# EAGLE design LPC2368 Breakout (EAGLE 6.2)
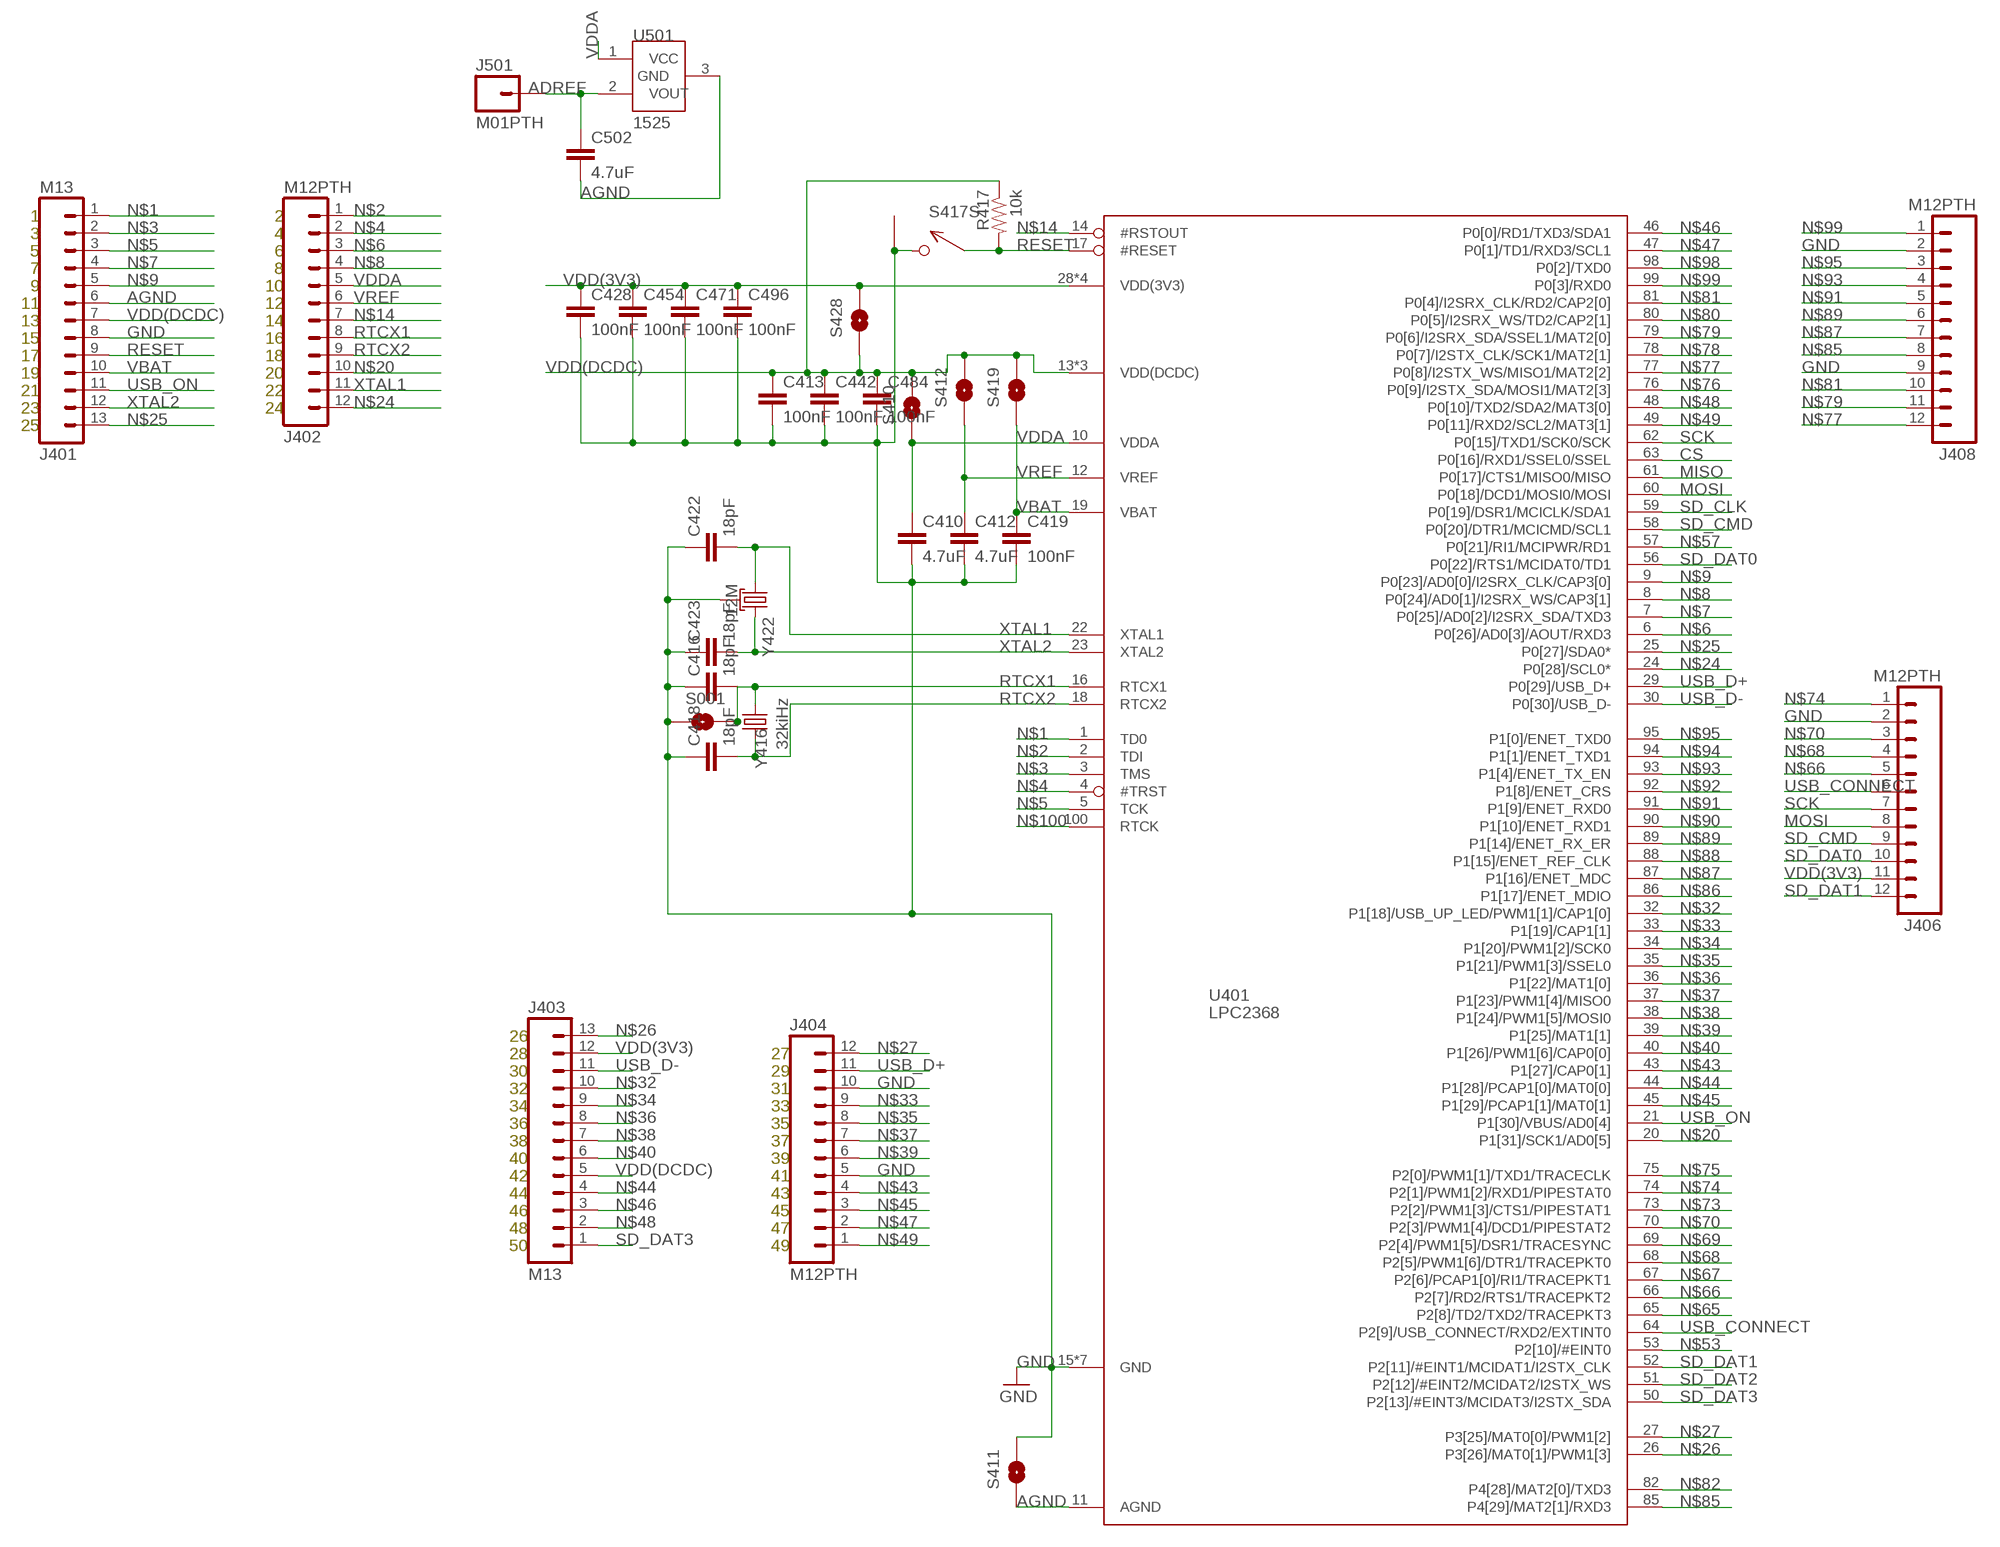
[diagram p0: schematic, sheet 1, part 1 of 2]
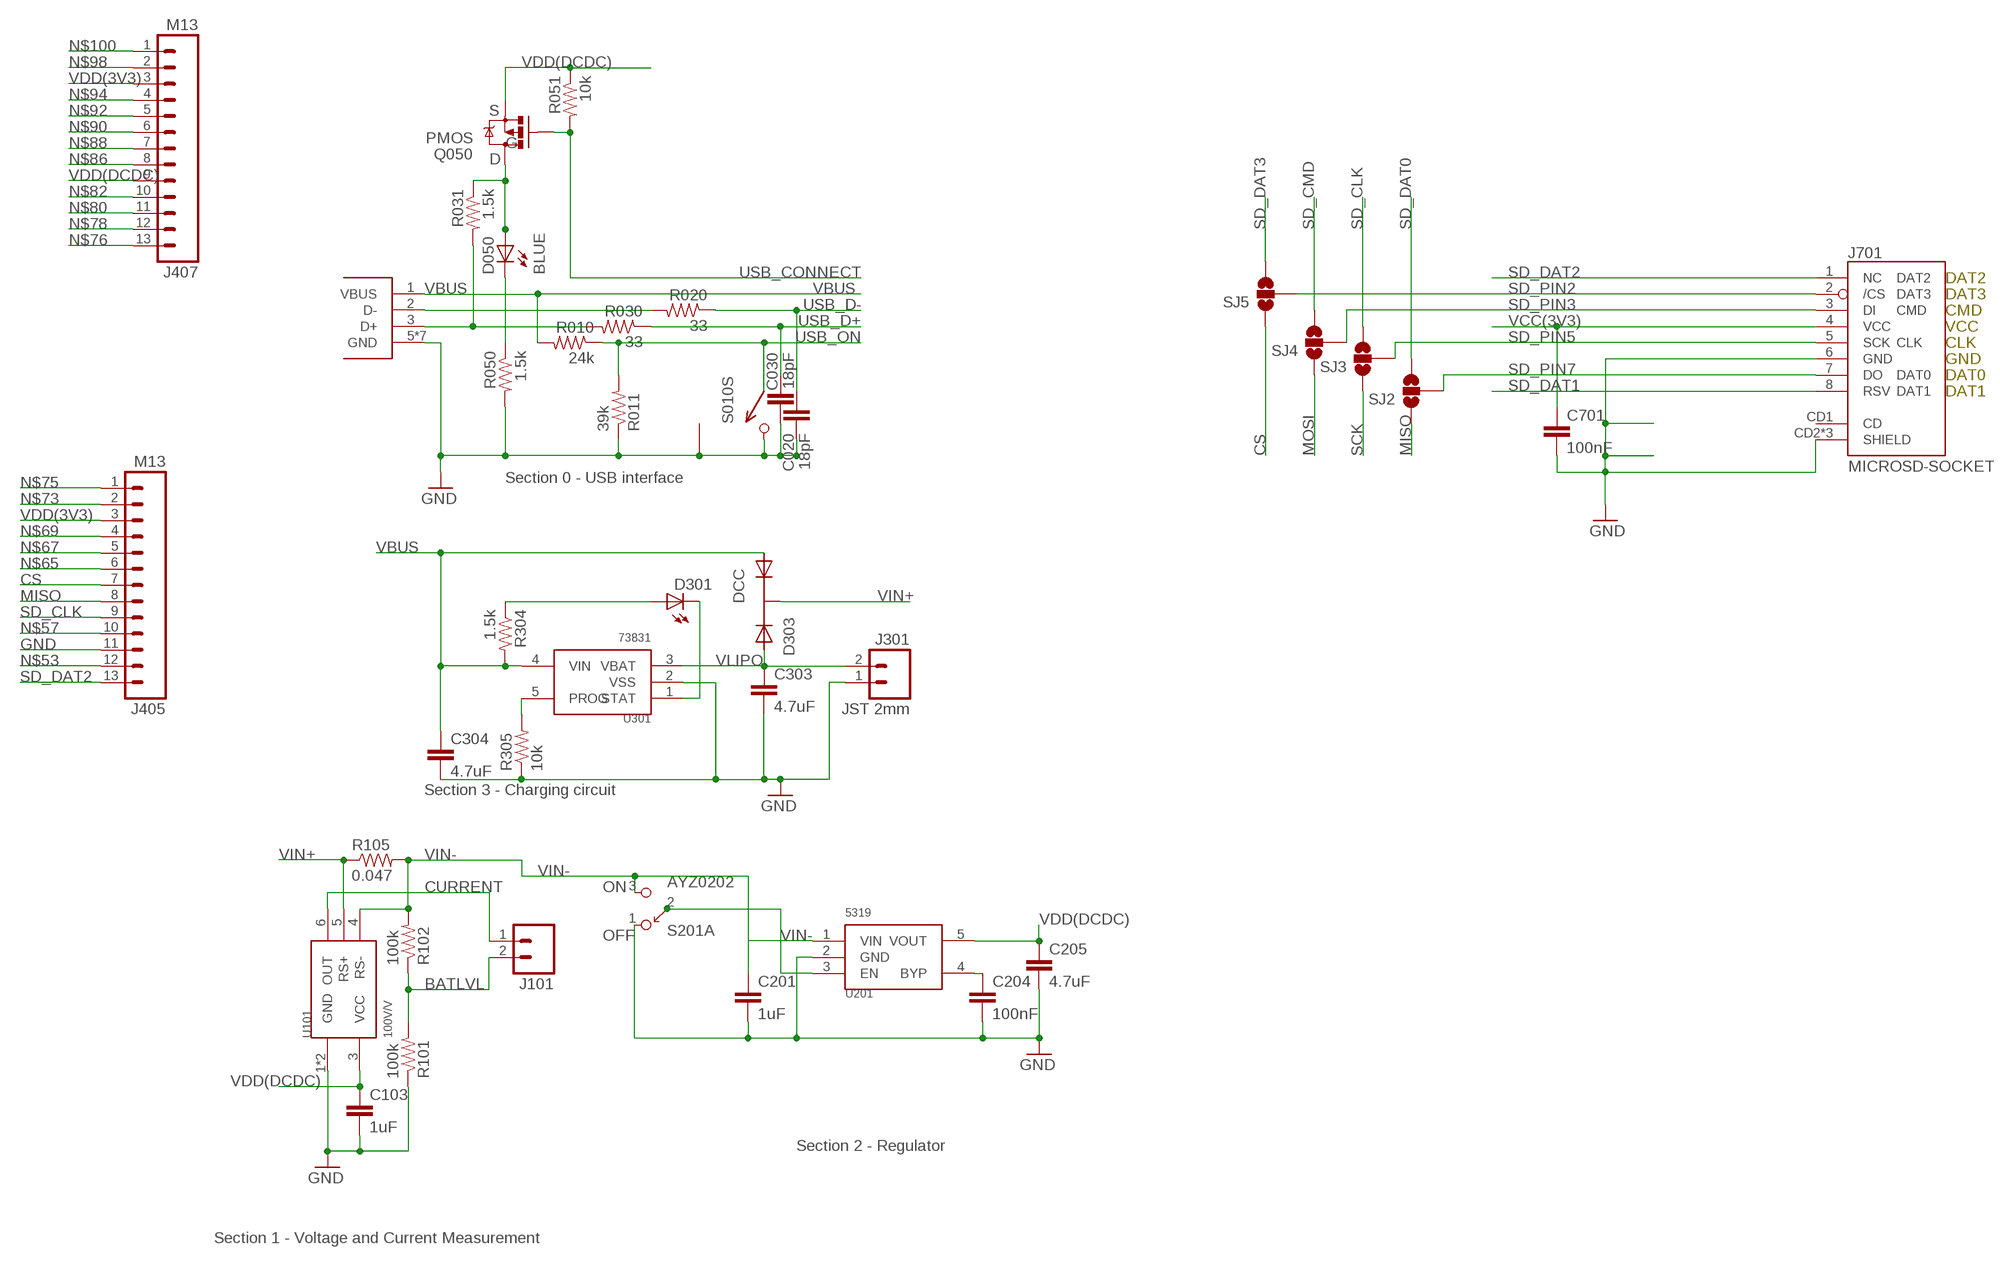
[diagram p1: schematic, sheet 1, part 2 of 2]

## Parts
C020  18pF  CAP0402-CAP  [0402-CAP]
C030  18pF  CAP0402-CAP  [0402-CAP]
C103  1uF  CAP0402-CAP  [0402-CAP]
C201  1uF  CAP0402-CAP  [0402-CAP]
C204  100nF  CAP0402-CAP  [0402-CAP]
C205  4.7uF  CAP0402-CAP  [0402-CAP]
C303  4.7uF  CAP0402-CAP  [0402-CAP]
C304  4.7uF  CAP0402-CAP  [0402-CAP]
C410  4.7uF  CAP0402-CAP  [0402-CAP]
C412  4.7uF  CAP0402-CAP  [0402-CAP]
C413  100nF  CAP0402-CAP  [0402-CAP]
C416  18pF  CAP0402-CAP  [0402-CAP]
C418  18pF  CAP0402-CAP  [0402-CAP]
C419  100nF  CAP0402-CAP  [0402-CAP]
C422  18pF  CAP0402-CAP  [0402-CAP]
C423  18pF  CAP0402-CAP  [0402-CAP]
C428  100nF  CAP0402-CAP  [0402-CAP]
C442  100nF  CAP0402-CAP  [0402-CAP]
C454  100nF  CAP0402-CAP  [0402-CAP]
C471  100nF  CAP0402-CAP  [0402-CAP]
C484  100nF  CAP0402-CAP  [0402-CAP]
C496  100nF  CAP0402-CAP  [0402-CAP]
C502  4.7uF  CAP0402-CAP  [0402-CAP]
C701  100nF  CAP0402-CAP  [0402-CAP]
D050  BLUE  LED0603  [LED-0603]
D301  YELLOW  LED0603  [LED-0603]
D303  DCC  PMEG2005CT  [SOT-23-3]
J001  USB_MICROB_JST  [UB-MC5BR3-SD204-4S]
J101  M02PTH  [1X02]
J301  JST 2mm  M02-JST-2MM-SMT  [JST-2-SMD]
J401  M13  [1X13]
J402  M12PTH  [1X12]
J403  M13  [1X13]
J404  M12PTH  [1X12]
J405  M13  [1X13]
J406  M12PTH  [1X12]
J407  M13  [1X13]
J408  M12PTH  [1X12]
J501  M01PTH  [1X01]
J701  MICROSD-SOCKET  [MICROSD-SOCKET-PP]
Q050  PMOS  MOSFET-PCHANNELSMD  [SOT23-3]
R010  24k  RESISTOR0402-RES  [0402-RES]
R011  39k  RESISTOR0402-RES  [0402-RES]
R020  33  RESISTOR0402-RES  [0402-RES]
R030  33  RESISTOR0402-RES  [0402-RES]
R031  1.5k  RESISTOR0402-RES  [0402-RES]
R050  1.5k  RESISTOR0402-RES  [0402-RES]
R051  10k  RESISTOR0402-RES  [0402-RES]
R101  100k  RESISTOR0402-RES  [0402-RES]
R102  100k  RESISTOR0402-RES  [0402-RES]
R105  0.047  RESISTOR0402-RES  [0402-RES]
R304  1.5k  RESISTOR0402-RES  [0402-RES]
R305  10k  RESISTOR0402-RES  [0402-RES]
R417  10k  RESISTOR0402-RES  [0402-RES]
S001  SOLDERJUMPERNO  [SJ_2S-NO]
S010  SPST  B3U-1100P  [B3U-1100P]
S201  AYZ0202  [AYZ0202]
S410  SOLDERJUMPERNO  [SJ_2S-NO]
S411  SOLDERJUMPERNO  [SJ_2S-NO]
S412  SOLDERJUMPERNO  [SJ_2S-NO]
S417  SPST  B3U-1100P  [B3U-1100P]
S419  SOLDERJUMPERNO  [SJ_2S-NO]
S428  SOLDERJUMPERNO  [SJ_2S-NO]
SJ2  SOLDERJUMPER_2WAYS  [SJ_3]
SJ3  SOLDERJUMPER_2WAYS  [SJ_3]
SJ4  SOLDERJUMPER_2WAYS  [SJ_3]
SJ5  SOLDERJUMPER_2WAYS  [SJ_3]
U101  100V/V  MAX4173  [SOT-23-6]
U201  5319  MIC5319D5  [SOT-23-5]
U301  73831  MCP73831  [SOT-23-5]
U401  LPC2368  [LQFP100]
U501  1525  MCP1525  [SOT-23-3]
Y416  32kiHz  ABS06  [ABS06]
Y422  12M  TSX-3225  [CRYSTAL_SMD]

## Nets
ADREF: C502.1 J501.1 U501.2(VOUT)
AGND: C502.2 J401.6 S411.1 U401.11(AGND) U501.3(GND)
BATLVL: J101.2 R101.2 R102.1
C_STAT: D301.C U301.1(STAT)
CONN_D+: J001.3(D+) R030.2 R031.2
CONN_D-: J001.2(D-) R020.2
CS: J405.7 SJ5.1 U401.63(P0[16]/RXD1/SSEL0/SSEL)
CURRENT: J101.1 U101.6(OUT)
DR_STAT: D301.A R304.1
GND: C020.2 C030.2 C103.2 C201.2 C204.2 C205.2 C303.2 C304.2 C410.2 C412.2 C413.2 C416.1 C418.1 C419.2 C422.1 C423.1 C428.2 C442.2 C454.2 C471.2 C484.2 C496.2 C701.2 J001.5(GND) J001.P$6(GND) J001.P$7(GND) J001.P$8(GND) J001.P$9(GND) J001.P$10(GND) J001.P$11(GND) J301.1 J401.8 J404.5 J404.10 J405.11 J406.2 J408.2 J408.9 J701.6(GND) J701.CD2(SHIELD) J701.GND1(SHIELD) J701.GND3(SHIELD) R011.1 R050.2 R101.1 R305.1 S001.1 S010.P$2 S010.P$3 S201.1 S411.2 S417.P$2 S417.P$3 U101.1(GND) U101.2(GND) U201.2(GND) U301.2(VSS) U401.15(GND) U401.31(GND) U401.41(GND) U401.55(GND) U401.72(GND) U401.83(GND) U401.97(GND) Y422.2(GND) Y422.4(GND)
MISO: J405.8 SJ2.1 U401.61(P0[17]/CTS1/MISO0/MISO)
MOSI: J406.8 SJ4.1 U401.60(P0[18]/DCD1/MOSI0/MOSI)
N$1: J401.1 U401.1(TD0)
N$2: J402.1 U401.2(TDI)
N$3: J401.2 U401.3(TMS)
N$4: J402.2 U401.4(#TRST)
N$5: J401.3 U401.5(TCK)
N$6: J402.3 U401.6(P0[26]/AD0[3]/AOUT/RXD3)
N$7: J401.4 U401.7(P0[25]/AD0[2]/I2SRX_SDA/TXD3)
N$8: J402.4 U401.8(P0[24]/AD0[1]/I2SRX_WS/CAP3[1])
N$9: J401.5 U401.9(P0[23]/AD0[0]/I2SRX_CLK/CAP3[0])
N$13: R305.2 U301.5(PROG)
N$14: J402.7 U401.14(#RSTOUT)
N$15: C204.1 U201.4(BYP)
N$16: D050.C R050.1
N$18: S201.2 U201.3(EN)
N$20: J402.10 U401.20(P1[31]/SCK1/AD0[5])
N$24: J402.12 U401.24(P0[28]/SCL0*)
N$25: J401.13 U401.25(P0[27]/SDA0*)
N$26: J403.13 U401.26(P3[26]/MAT0[1]/PWM1[3])
N$27: J404.12 U401.27(P3[25]/MAT0[0]/PWM1[2])
N$28: D050.A Q050.3(D) R031.1
N$32: J403.10 U401.32(P1[18]/USB_UP_LED/PWM1[1]/CAP1[0])
N$33: J404.9 U401.33(P1[19]/CAP1[1])
N$34: J403.9 U401.34(P1[20]/PWM1[2]/SCK0)
N$35: J404.8 U401.35(P1[21]/PWM1[3]/SSEL0)
N$36: J403.8 U401.36(P1[22]/MAT1[0])
N$37: J404.7 U401.37(P1[23]/PWM1[4]/MISO0)
N$38: J403.7 U401.38(P1[24]/PWM1[5]/MOSI0)
N$39: J404.6 U401.39(P1[25]/MAT1[1])
N$40: J403.6 U401.40(P1[26]/PWM1[6]/CAP0[0])
N$43: J404.4 U401.43(P1[27]/CAP0[1])
N$44: J403.4 U401.44(P1[28]/PCAP1[0]/MAT0[0])
N$45: J404.3 U401.45(P1[29]/PCAP1[1]/MAT0[1])
N$46: J403.3 U401.46(P0[0]/RD1/TXD3/SDA1)
N$47: J404.2 U401.47(P0[1]/TD1/RXD3/SCL1)
N$48: J403.2 U401.48(P0[10]/TXD2/SDA2/MAT3[0])
N$49: J404.1 U401.49(P0[11]/RXD2/SCL2/MAT3[1])
N$53: J405.12 U401.53(P2[10]/#EINT0)
N$57: J405.10 U401.57(P0[21]/RI1/MCIPWR/RD1)
N$65: J405.6 U401.65(P2[8]/TD2/TXD2/TRACEPKT3)
N$66: J406.5 U401.66(P2[7]/RD2/RTS1/TRACEPKT2)
N$67: J405.5 U401.67(P2[6]/PCAP1[0]/RI1/TRACEPKT1)
N$68: J406.4 U401.68(P2[5]/PWM1[6]/DTR1/TRACEPKT0)
N$69: J405.4 U401.69(P2[4]/PWM1[5]/DSR1/TRACESYNC)
N$70: J406.3 U401.70(P2[3]/PWM1[4]/DCD1/PIPESTAT2)
N$73: J405.2 U401.73(P2[2]/PWM1[3]/CTS1/PIPESTAT1)
N$74: J406.1 U401.74(P2[1]/PWM1[2]/RXD1/PIPESTAT0)
N$75: J405.1 U401.75(P2[0]/PWM1[1]/TXD1/TRACECLK)
N$76: J407.13 U401.76(P0[9]/I2STX_SDA/MOSI1/MAT2[3])
N$77: J408.12 U401.77(P0[8]/I2STX_WS/MISO1/MAT2[2])
N$78: J407.12 U401.78(P0[7]/I2STX_CLK/SCK1/MAT2[1])
N$79: J408.11 U401.79(P0[6]/I2SRX_SDA/SSEL1/MAT2[0])
N$80: J407.11 U401.80(P0[5]/I2SRX_WS/TD2/CAP2[1])
N$81: J408.10 U401.81(P0[4]/I2SRX_CLK/RD2/CAP2[0])
N$82: J407.10 U401.82(P4[28]/MAT2[0]/TXD3)
N$85: J408.8 U401.85(P4[29]/MAT2[1]/RXD3)
N$86: J407.8 U401.86(P1[17]/ENET_MDIO)
N$87: J408.7 U401.87(P1[16]/ENET_MDC)
N$88: J407.7 U401.88(P1[15]/ENET_REF_CLK)
N$89: J408.6 U401.89(P1[14]/ENET_RX_ER)
N$90: J407.6 U401.90(P1[10]/ENET_RXD1)
N$91: J408.5 U401.91(P1[9]/ENET_RXD0)
N$92: J407.5 U401.92(P1[8]/ENET_CRS)
N$93: J408.4 U401.93(P1[4]/ENET_TX_EN)
N$94: J407.4 U401.94(P1[1]/ENET_TXD1)
N$95: J408.3 U401.95(P1[0]/ENET_TXD0)
N$98: J407.2 U401.98(P0[2]/TXD0)
N$99: J408.1 U401.99(P0[3]/RXD0)
N$100: J407.1 U401.100(RTCK)
RESET: J401.9 R417.2 S417.P$1 U401.17(#RESET)
RTCX1: C416.2 J402.8 S001.2 U401.16(RTCX1) Y416.1
RTCX2: C418.2 J402.9 U401.18(RTCX2) Y416.2
SCK: J406.7 SJ3.1 U401.62(P0[15]/TXD1/SCK0/SCK)
SD_CLK: J405.9 SJ3.3 U401.59(P0[19]/DSR1/MCICLK/SDA1)
SD_CMD: J406.9 SJ4.3 U401.58(P0[20]/DTR1/MCICMD/SCL1)
SD_DAT0: J406.10 SJ2.3 U401.56(P0[22]/RTS1/MCIDAT0/TD1)
SD_DAT1: J406.12 J701.8(RSV) U401.52(P2[11]/#EINT1/MCIDAT1/I2STX_CLK)
SD_DAT2: J405.13 J701.1(NC) U401.51(P2[12]/#EINT2/MCIDAT2/I2STX_WS)
SD_DAT3: J403.1 SJ5.3 U401.50(P2[13]/#EINT3/MCIDAT3/I2STX_SDA)
SD_PIN2: J701.2(/CS) SJ5.2
SD_PIN3: J701.3(DI) SJ4.2
SD_PIN5: J701.5(SCK) SJ3.2
SD_PIN7: J701.7(DO) SJ2.2
USB_CONNECT: J406.6 Q050.1(G) R051.2 U401.64(P2[9]/USB_CONNECT/RXD2/EXTINT0)
USB_D+: C030.1 J404.11 R030.1 U401.29(P0[29]/USB_D+)
USB_D-: C020.1 J403.11 R020.1 U401.30(P0[30]/USB_D-)
USB_ON: J401.11 R010.1 R011.2 S010.P$1 U401.21(P1[30]/VBUS/AD0[4])
VBAT: C419.1 J401.10 S419.1 U401.19(VBAT)
VBUS [power]: C304.1 D303.1(A1) J001.1(VBUS) R010.2 R304.2 U301.4(VIN)
VCC(3V3): C701.1 J701.4(VCC)
VDD(3V3): C428.1 C454.1 C471.1 C496.1 J403.12 J405.3 J406.11 J407.3 S428.2 U401.28(VDD(3V3)) U401.54(VDD(3V3)) U401.71(VDD(3V3)) U401.96(VDD(3V3))
VDD(DCDC): C103.1 C205.1 C413.1 C442.1 C484.1 J401.7 J403.5 J407.9 Q050.2(S) R051.1 R417.1 S410.2 S412.2 S419.2 S428.1 U101.3(VCC) U201.5(VOUT) U401.13(VDD(DCDC)) U401.42(VDD(DCDC)) U401.84(VDD(DCDC))
VDDA: C410.1 J402.5 S410.1 U401.10(VDDA) U501.1(VCC)
VIN+: D303.3(K) R105.1 U101.5(RS+)
VIN-: C201.1 R102.2 R105.2 S201.3 U101.4(RS-) U201.1(VIN)
VLIPO [power]: C303.1 D303.2(A2) J301.2 U301.3(VBAT)
VREF: C412.1 J402.6 S412.1 U401.12(VREF)
XTAL1: C422.2 J402.11 U401.22(XTAL1) Y422.1
XTAL2: C423.2 J401.12 U401.23(XTAL2) Y422.3
Unconnected: J701.CD1(CD) S201.4 S201.5 S201.6

## Notes on the sheet
- 1 | 2
- 3 | 4
- 5 | 6
- 7 | 8
- 9 | 10
- 11 | 12 | S
- 13 | 14
- 15 | 16 | G
- 17 | 18 | D
- 19 | 20
- 21 | 22
- 23 | 24
- 25
- DAT2
- DAT3
- CMD
- VCC
- CLK
- GND
- DAT0
- DAT1
- Section 0 - USB interface
- 26 | Section 3 - Charging circuit
- 28 | 27
- 30 | 29
- 32 | 31
- 34 | 33
- 36 | 35
- 38 | 37 | ON
- 40 | 39
- 42 | 41
- 44 | 43 | OFF
- 46 | 45
- 48 | 47
- 50 | 49
- Section 2 - Regulator
- Section 1 - Voltage and Current Measurement

## Library data of the parts
C020 C030 C103 C201 C204 C205 C303 C304 C502 C701 = SparkFun:CAP: Capacitor Standard 0603 ceramic capacitor, and 0.1" leaded capacitor.
C410 C412 C413 C416 C418 C419 C422 C423 C428 C442 C454 C471 C484 C496 = SparkFun-Passives:CAP: Capacitor Standard 0603 ceramic capacitor, and 0.1" leaded capacitor.
D050 D301 = SparkFun:LED: LEDs Standard schematic elements and footprints for 5mm, 3mm, 1206, and 0603 sized LEDs. 5mm - Spark Fun Electronics SKU : COM-00529 (and others)
D303 = KwanSystems:PMEG2005CT
J001 = KwanSystems:USB_MICROB_JST
J101 = SparkFun-Connectors:M02: Header 2 Standard 2-pin 0.1" header. Use with straight break away headers (SKU : PRT-00116), right angle break away headers (PRT-00553), swiss pins (PRT-00743), machine pins (PRT-00117), and female headers (PRT-00115). Molex polarized connector foot print use with SKU : PRT-08233 with associated crimp pins and housings.
J301 = SparkFun:M02: Header 2 Standard 2-pin 0.1" header. Use with straight break away headers (SKU : PRT-00116), right angle break away headers (PRT-00553), swiss pins (PRT-00743), machine pins (PRT-00117), and female headers (PRT-00115). Molex polarized connector foot print use with SKU : PRT-08233 with associated crimp pins and housings.
J401 J403 J405 J407 = SparkFun-Connectors:M13: 13-pin single row .1" header
J402 J404 J406 J408 = SparkFun-Connectors:M12: Header 12 Standard 12-pin 0.1" header. Use with straight break away headers (SKU : PRT-00116), right angle break away headers (PRT-00553), swiss pins (PRT-00743), machine pins (PRT-00117), and female headers (PRT-00115).
J501 = SparkFun-Connectors:M01: Header 1 Standard 1-pin 0.1" header. Use with straight break away headers (SKU : PRT-00116), right angle break away headers (PRT-00553), swiss pins (PRT-00743), machine pins (PRT-00117), and female headers (PRT-00115).
J701 = KwanSystems:MICROSD-SOCKET: microSD Socket Push-push type uSD socket. Digikey 101-00660-68-6-1-ND. tDoc lines correctly indicate media card edge positions when inserting (unlocked, locked, depressed).
Q050 = SparkFun:MOSFET-PCHANNEL
R010 R011 R020 R030 R031 R050 R051 R101 R102 R105 R304 R305 R417 = SparkFun:RESISTOR: Resistor Basic schematic elements and footprints for 0603, 1206, and PTH resistors.
S001 S410-S412 S419 S428 = SparkFun-Passives:SOLDERJUMPER: Solder Jumper Standard SMD solder jumper. Used to automate production. Two varients : Normally Open and Normally Closed are the same, but have different paste layers. NC will have a large amount of paste and should jumper during reflow.
S010 S417 = KwanSystems:B3U-1100P
S201 = KwanSystems:AYZ0202
SJ2-SJ5 = SparkFun-Passives:SOLDERJUMPER_2WAY: Solder Jumper 2 way solder jumper
U101 = KwanSystems:MAX4173
U201 = KwanSystems:MIC5319
U301 = KwanSystems:MCP73831
U401 = KwanSystems:LPC2368
U501 = KwanSystems:MCP1525
Y416 = KwanSystems:ABS06
Y422 = KwanSystems:TSX-3225

## Net classes
0 default: width 0.152 mm, drill 0.33 mm, clearance 0.152 mm
1 power: width 0.152 mm, drill 0.33 mm, clearance 0.152 mm to class 0, clearance 0.152 mm

## Board
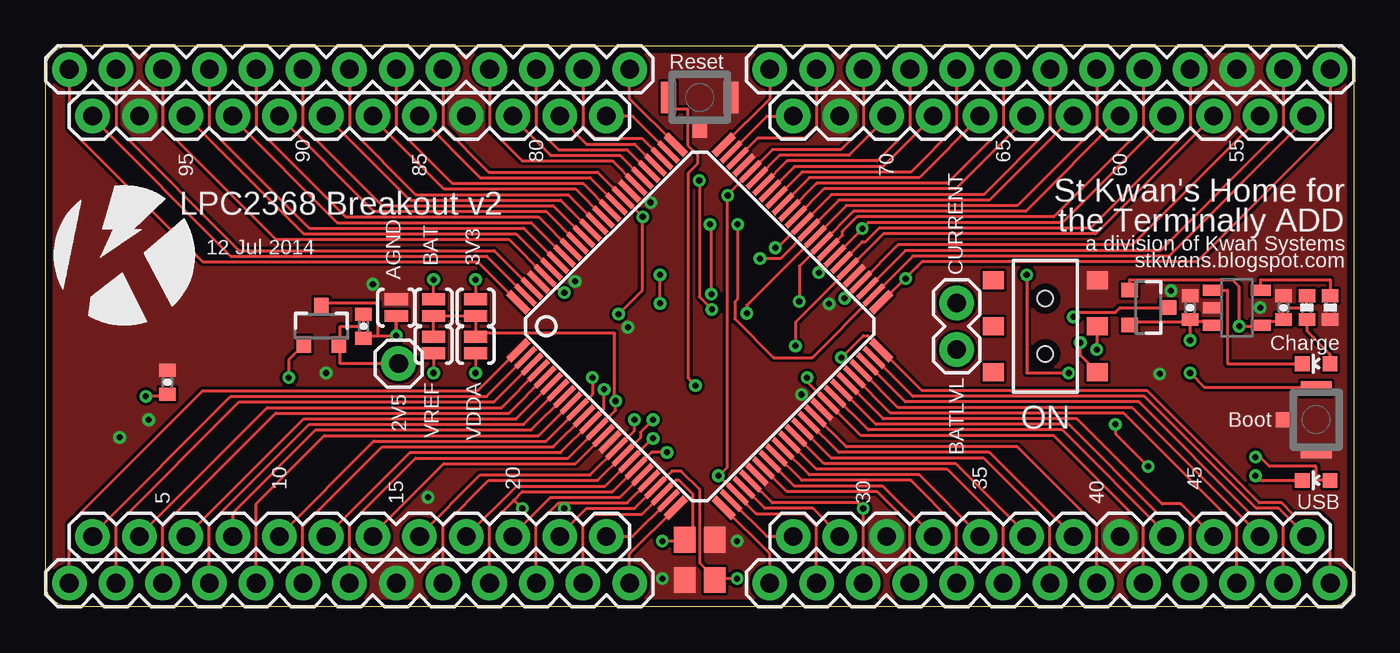
[diagram p2: board, top side]
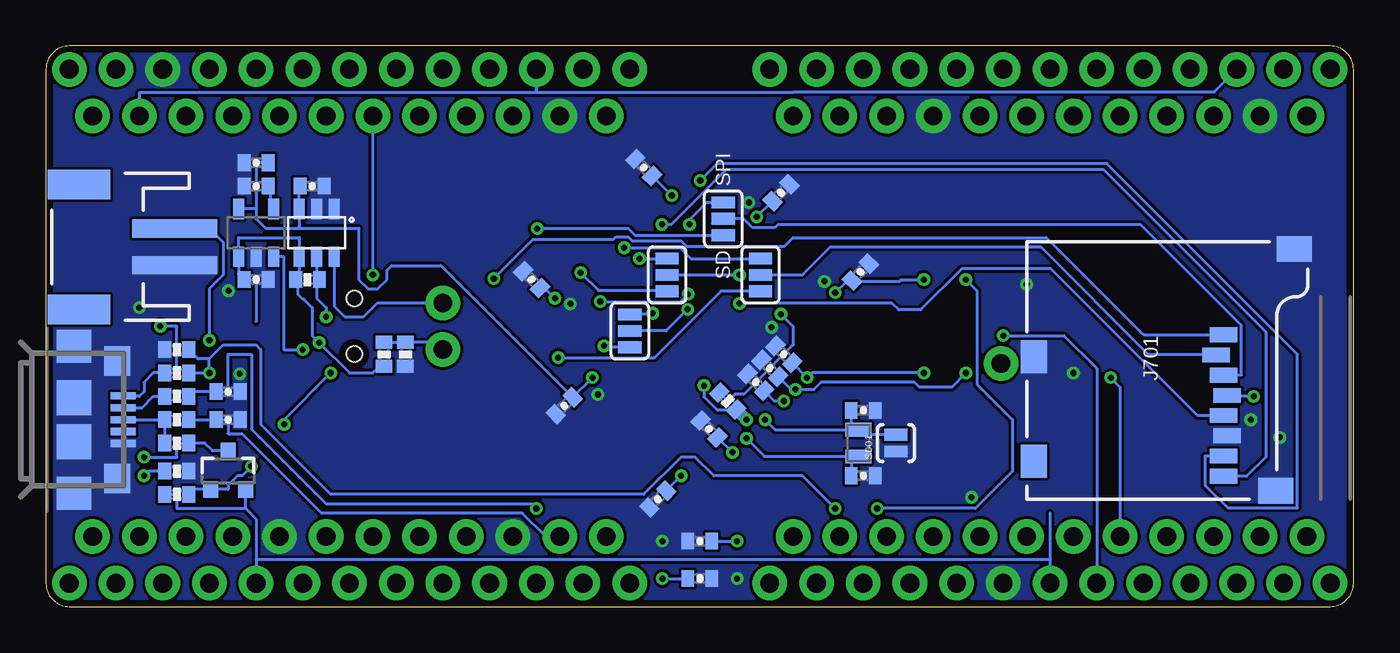
[diagram p3: board, bottom side, seen from below]

Size 71.12 x 30.48 mm. Coordinates in mm from the lower left corner, seen from the top.
Outline: 1.27,30.48 69.85,30.48 arc-90 71.12,29.21 71.12,1.27 arc-90 69.85,0 1.27,0 arc-90 0,1.27 0,29.21 arc-90 1.27,30.48
Copper layers (1*16): Top 0.0356mm / dielectric 1.5011mm / Bottom 0.0356mm
Design rules: minimum track width 6mil, minimum drill 13mil, track to track 6mil, track to pad 6mil, pad to pad 6mil, via to via 6mil, smd to smd 6mil, copper to edge 15mil, drill to drill 6mil, minimum pad ring 7mil, minimum via ring 7mil, stop-mask expansion 4mil, vias tented up to drill 14mil, thermal gap 10mil

### Footprints (pad centres in the part's own frame; a part is rotated, then mirrored left to right if it is on the bottom)
0402-CAP = smd 0.7 x 0.9: 1 -0.65,0; 2 0.65,0
LED-0603 = smd 0.8 x 0.8: A 0,-0.75; C 0,0.75
SOT-23-3 = smd 0.9 x 0.8: 1 -1,0.95; 2 -1,-0.95; 3 1.1,0
UB-MC5BR3-SD204-4S = smd 0.4 x 1.35: 1 -1.3,2.675; 2 -0.65,2.675; 3 0,2.675; 4 0.65,2.675; 5 1.3,2.675 | smd 1.8 x 1.9: P$6 4,0; P$7 -4,0 | smd 1.9 x 1.9: P$8 -1.2,0; P$9 1.2,0 | smd 1.6 x 1.4: P$10 -3.2,2.35; P$11 3.2,2.35
1X02 = drill 1.016 pad 1.88: 1 0,0; 2 2.54,0
JST-2-SMD = smd 1 x 4.6: 1 -1,-3.7; 2 1,-3.7 | smd 1.6 x 3.4: NC1 -3.4,1.5; NC2 3.4,1.5
1X13 = drill 1.016 pad 1.88: 1 0,0; 2 2.54,0; 3 5.08,0; 4 7.62,0; 5 10.16,0; 6 12.7,0; 7 15.24,0; 8 17.78,0; 9 20.32,0; 10 22.86,0; 11 25.4,0; 12 27.94,0; 13 30.48,0
1X12 = drill 1.016 pad 1.88: 1 0,0; 2 2.54,0; 3 5.08,0; 4 7.62,0; 5 10.16,0; 6 12.7,0; 7 15.24,0; 8 17.78,0; 9 20.32,0; 10 22.86,0; 11 25.4,0; 12 27.94,0
1X01 = drill 1.016 pad 1.88: 1 0,0
MICROSD-SOCKET-PP = smd 0.8 x 1.5: 1 -8.94,10.7; 2 -7.84,10.3; 3 -6.74,10.7; 4 -5.64,10.9; 5 -4.54,10.7; 6 -3.44,10.9; 7 -2.34,10.7; 8 -1.24,10.7 | smd 1.8 x 1.4: CD1 -2.05,0.4; CD2 -7.75,0.4 | smd 1.4 x 1.9: GND1 -13.6,14.55; GND3 -0.45,13.55
SOT23-3 = smd 0.8 x 0.9: 1 -0.95,-1; 2 0.95,-1; 3 0,1.1
0402-RES = smd 0.7 x 0.9: 1 -0.65,0; 2 0.65,0
SJ_2S-NO = smd 0.635 x 1.27: 1 -0.45,0; 2 0.45,0
B3U-1100P = smd 0.8 x 1.7: P$1 -1.7,0; P$2 1.7,0 | smd 0.8 x 1.1: P$3 0,-1.65
AYZ0202 = smd 1 x 1.15: 1 -2.5,2.825; 2 0,2.825; 3 2.5,2.825; 4 -2.5,-2.825; 5 0,-2.825; 6 2.5,-2.825 | hole 0.85: 1.5,0; -1.5,0
SJ_3 = smd 0.635 x 1.27: 1 -0.889,0; 2 0,0; 3 0.889,0
SOT-23-6 = smd 0.6 x 1.1: 1 -0.95,-1.3; 2 0,-1.3; 3 0.95,-1.3; 4 0.95,1.3; 5 0,1.3; 6 -0.95,1.3
SOT-23-5 = smd 0.6 x 1.1: 1 -0.95,-1.3; 2 0,-1.3; 3 0.95,-1.3; 4 0.95,1.3; 5 -0.95,1.3
LQFP100 = smd 1.5 x 0.4: 1 -7.9,6.06; 25 -7.9,-6.06; 51 7.9,-6.06; 75 7.9,6.06 | smd 1.5 x 0.28: 2 -7.9,5.5; 3 -7.9,5; 4 -7.9,4.5; 5 -7.9,4; 6 -7.9,3.5; 7 -7.9,3; 8 -7.9,2.5; 9 -7.9,2; 10 -7.9,1.5; 11 -7.9,1; 12 -7.9,0.5; 13 -7.9,0; 14 -7.9,-0.5; 15 -7.9,-1; 16 -7.9,-1.5; 17 -7.9,-2; 18 -7.9,-2.5; 19 -7.9,-3; 20 -7.9,-3.5; 21 -7.9,-4; 22 -7.9,-4.5; 23 -7.9,-5; 24 -7.9,-5.5; 52 7.9,-5.5; 53 7.9,-5; 54 7.9,-4.5; 55 7.9,-4; 56 7.9,-3.5; 57 7.9,-3; 58 7.9,-2.5; 59 7.9,-2; 60 7.9,-1.5; 61 7.9,-1; 62 7.9,-0.5; 63 7.9,0; 64 7.9,0.5; 65 7.9,1; 66 7.9,1.5; 67 7.9,2; 68 7.9,2.5; 69 7.9,3; 70 7.9,3.5; 71 7.9,4; 72 7.9,4.5; 73 7.9,5; 74 7.9,5.5 | smd 0.4 x 1.5: 26 -6.06,-7.9; 50 6.06,-7.9; 76 6.06,7.9; 100 -6.06,7.9 | smd 0.28 x 1.5: 27 -5.5,-7.9; 28 -5,-7.9; 29 -4.5,-7.9; 30 -4,-7.9; 31 -3.5,-7.9; 32 -3,-7.9; 33 -2.5,-7.9; 34 -2,-7.9; 35 -1.5,-7.9; 36 -1,-7.9; 37 -0.5,-7.9; 38 0,-7.9; 39 0.5,-7.9; 40 1,-7.9; 41 1.5,-7.9; 42 2,-7.9; 43 2.5,-7.9; 44 3,-7.9; 45 3.5,-7.9; 46 4,-7.9; 47 4.5,-7.9; 48 5,-7.9; 49 5.5,-7.9; 77 5.5,7.9; 78 5,7.9; 79 4.5,7.9; 80 4,7.9; 81 3.5,7.9; 82 3,7.9; 83 2.5,7.9; 84 2,7.9; 85 1.5,7.9; 86 1,7.9; 87 0.5,7.9; 88 0,7.9; 89 -0.5,7.9; 90 -1,7.9; 91 -1.5,7.9; 92 -2,7.9; 93 -2.5,7.9; 94 -3,7.9; 95 -3.5,7.9; 96 -4,7.9; 97 -4.5,7.9; 98 -5,7.9; 99 -5.5,7.9
ABS06 = smd 0.75 x 1.4: 1 -0.725,0; 2 0.725,0
CRYSTAL_SMD = smd 1.4 x 1.15: 1 -1.092,-0.813; 2 1.092,-0.813; 3 1.092,0.813; 4 -1.092,0.813

### Placement (x,y rotation side)
C020  61.21,11.68 0 bottom
C030  61.21,10.16 0 bottom
C103  56.64,22.86 0 bottom
C201  59.69,17.78 0 bottom
C204  59.69,22.86 180 bottom
C205  59.69,24.13 180 bottom
C303  62.23,16.26 90 top
C304  67.31,16.26 90 top
C410  30.99,13.72 135 bottom
C412  31.75,12.95 135 bottom
C413  32.51,12.19 135 bottom
C416  26.67,10.67 180 bottom
C418  26.67,7.11 180 bottom
C419  35.05,9.65 135 bottom
C422  35.56,1.52 180 bottom
C423  35.56,3.56 0 bottom
C428  37.85,5.84 225 bottom
C442  42.93,10.92 225 bottom
C454  44.7,17.78 135 bottom
C471  38.61,23.88 135 bottom
C484  31.14,22.5 45 bottom
C496  26.82,18.19 45 bottom
C502  17.27,15.24 270 top
C701  6.6,12.19 90 top
D050  69.09,6.86 90 top
D301  69.09,13.21 90 top
D303  59.94,16.26 0 top
J001  69.6,10.16 270 bottom
J101  49.53,16.51 270 top
J301  67.82,19.56 90 bottom
J401  1.27,1.27 0 top
J402  2.54,3.81 0 top
J403  69.85,1.27 180 top
J404  68.58,3.81 180 top
J405  39.37,29.21 0 top
J406  40.64,26.67 0 top
J407  1.27,29.21 0 top
J408  2.54,26.67 0 top
J501  19.18,13.21 0 top
J701  17.78,5.84 270 bottom
Q050  61.21,7.37 0 bottom
R010  64.01,12.7 180 bottom
R011  64.01,13.97 0 bottom
R020  64.01,11.43 180 bottom
R030  64.01,10.16 180 bottom
R031  64.01,8.89 180 bottom
R050  64.01,7.37 0 bottom
R051  64.01,6.1 0 bottom
R101  51.56,13.72 90 bottom
R102  52.73,13.72 270 bottom
R105  56.9,17.78 180 bottom
R304  68.58,16.26 90 top
R305  69.85,16.26 90 top
R417  34.04,11.18 315 bottom
S001  24.89,8.89 90 bottom
S010  69.09,10.16 270 top
S201  54.36,15.24 270 top
S410  23.37,14.22 90 top
S411  19.05,16.26 90 top
S412  21.08,14.22 90 top
S417  35.56,27.69 0 top
S419  21.08,16.26 270 top
S428  23.37,16.26 90 top
SJ2  39.37,14.99 270 bottom
SJ3  37.34,18.03 270 bottom
SJ4  34.29,21.08 270 bottom
SJ5  32.26,18.03 270 bottom
U101  56.39,20.32 180 bottom
U201  59.69,20.32 0 bottom
U301  64.77,16.26 270 top
U401  35.56,15.24 45 top
U501  14.99,15.24 90 top
U$1  [KWAN_CIRCLE]  4.27,19.1 0 top
Y416  26.92,8.89 270 bottom
Y422  35.56,2.54 90 top

### Tracks (layer width: path | path; a pad name or v marks a point on that pad's centre or on a via)
ADREF
  Top 0.152: 17.27,16 C502.1 17.27,15.24 16,15.24 16,14.31 U501.2 15.94,14.22 16,14.22 16,13.21 J501.1
AGND  (via drill 0.33)
  Top 0.152: J401.6 13.97,4.37 18.29,8.69 27.59,8.69 U401.11 | C502.2 17.41,14.73 18.03,14.73 | U501.3 15.16,16.51 18.03,16.51 18.03,14.73 | 18.03,14.73 v19.05,14.73 S411.1 19.05,14.86
  Bottom 0.152: J401.6 13.97,12.95 15.75,14.73 v19.05,14.73
BATLVL
  Bottom 0.152: R102.1 R101.2 49.93,14.37 J101.2
C_STAT
  Top 0.152: U301.1 64.26,17.21 64.26,13.21 D301.C
CONN_D+
  Bottom 0.152: R031.2 R030.2 J001.3
CONN_D-
  Bottom 0.152: 64.55,11.06 arc90 R020.2 65.28,11.43 65.9,10.81 J001.2
CS  (via drill 0.33)
  Top 0.152: J405.7 54.61,26.01 51,22.4 42.72,22.4 U401.63 41.07,20.8 39.78,19.51 v39.67,19.51
  Bottom 0.152: v39.67,19.51 36.63,19.51 36.04,18.92 SJ5.1
CURRENT
  Bottom 0.152: U101.6 55.44,16.32 54.86,15.75 53.85,15.75 53.09,16.51 J101.1
DR_STAT
  Top 0.152: R304.1 68.58,14.99 69.84,13.73 D301.A
GND  (via drill 0.33)
  other vias: 33.53,1.52 37.59,3.56 66.04,16.26 60.58,12.65 61.19,17.17 20.78,5.94 17.78,17.53 42.6,16.46 41.1,11.53 32.89,21.97 28.78,17.68 31.65,15.19 15.24,12.7 5.59,10.16 4.01,9.19
  pour Bottom (no thermals): 1.27,30.48 69.85,30.48 arc-90 71.12,29.21 71.12,1.27 arc-90 69.85,0 1.27,0 arc-90 0,1.27 0,29.21 arc-90
  pour Top (no thermals): 1.27,30.48 69.85,30.48 arc-90 71.12,29.21 71.12,1.27 arc-90 69.85,0 1.27,0 arc-90 0,1.27 0,29.21 arc-90
MISO  (via drill 0.33)
  Top 0.152: J405.8 57.15,26.11 52.83,21.79 43.53,21.79 U401.61 38.12,16.39 v38.12,15.95
  Bottom 0.152: v38.12,15.95 38.18,15.9 39.4,15.9 SJ2.1
MOSI  (via drill 0.33)
  Top 0.152: J406.8 58.42,26.62 53.29,21.49 43.93,21.49 U401.60 42.16,19.71 40.97,18.52 v40.97,16.59 | v36.12,20.78 36.2,20.7 v36.2,16.99
  Bottom 0.152: v36.2,16.99 36.6,16.59 v40.97,16.59 | SJ4.1 35.18,21.97 36.12,21.03 v36.12,20.78
N$1
  Top 0.152: J401.1 1.27,4.47 8.53,11.73 23.48,11.73 U401.1
N$2
  Top 0.152: J402.1 2.54,3.91 10.06,11.43 23.97,11.43 U401.2
N$3
  Top 0.152: J401.2 3.81,4.42 10.52,11.12 24.37,11.12 U401.3
N$4
  Top 0.152: J402.2 5.08,3.86 12.04,10.82 24.78,10.82 U401.4
N$5
  Top 0.152: J401.3 6.35,4.37 12.5,10.52 25.18,10.52 U401.5
N$6
  Top 0.152: J402.3 14.02,10.21 25.58,10.21 U401.6
N$7
  Top 0.152: J401.4 8.89,4.47 14.33,9.91 25.98,9.91 U401.7
N$8
  Top 0.152: 10.16,3.91 J402.4 10.16,5.08 14.68,9.6 26.39,9.6 U401.8
N$9
  Top 0.152: J401.5 11.43,5.59 15.14,9.3 26.79,9.3 U401.9
N$13
  Top 0.152: 69.85,16.76 R305.2 69.85,17.78 66.07,17.78 66.07,17.27 | 66.04,17.27 66.07,17.27 | 66.07,17.27 U301.5
N$14
  Top 0.152: J402.7 17.78,3.91 21.64,7.77 28.8,7.77 U401.14
N$15
  Bottom 0.152: C204.1 58.93,22.75 58.93,21.62 U201.4
N$16  (via drill 0.33)
  Top 0.152: D050.C 66.04,6.86 v65.79,7.11
  Bottom 0.152: R050.1 65.53,7.37 v65.79,7.11
N$18  (via drill 0.33)
  Top 0.152: S201.2 57.15,15.24 v57.15,13.97
  Bottom 0.152: v57.15,13.97 58.17,13.97 58.17,19.02 U201.3
N$20
  Top 0.152: J402.10 25.4,3.91 27.43,5.94 31.21,5.94 U401.20
N$24
  Top 0.152: J402.12 31.91,3.81 U401.24
N$25
  Top 0.152: J401.13 31.75,2.86 U401.25
N$26
  Top 0.152: J403.13 39.37,2.86 U401.26
N$27
  Top 0.152: U401.27 39.21,3.81 J404.12
N$28  (via drill 0.33)
  Top 0.152: D050.A 69.09,6.86 69.09,7.62 66.55,7.62 66.04,8.13 v65.79,8.13
  Bottom 0.152: v65.79,8.13 64.01,8.13 64.01,8.89 R031.1 | R031.1 63.25,8.89 | Q050.3 62.06,8.47 62.48,8.89 R031.1
N$32
  Top 0.152: J403.10 46.99,4.47 45.21,6.25 40.31,6.25 U401.32
N$33
  Top 0.152: J404.9 45.52,6.55 40.71,6.55 U401.33
N$34
  Top 0.152: J403.9 49.53,4.37 47.04,6.86 41.11,6.86 U401.34
N$35
  Top 0.152: J404.8 50.8,3.86 47.5,7.16 41.52,7.16 U401.35
N$36
  Top 0.152: J403.8 52.07,4.42 49.02,7.47 41.92,7.47 U401.36
N$37
  Top 0.152: J404.7 53.34,3.91 49.48,7.77 42.32,7.77 U401.37
N$38
  Top 0.152: J403.7 54.61,4.47 51,8.08 42.72,8.08 U401.38
N$39
  Top 0.152: J404.6 51.31,8.38 43.12,8.38 U401.39
N$40
  Top 0.152: J403.6 57.15,4.37 52.83,8.69 43.53,8.69 U401.40
N$43
  Top 0.152: J404.4 60.96,3.91 55.27,9.6 44.73,9.6 U401.43
N$44
  Top 0.152: J403.4 62.23,4.47 61.62,5.08 60.45,5.08 55.63,9.91 45.14,9.91 U401.44
N$45
  Top 0.152: U401.45 45.54,10.21 56.08,10.21 60.71,5.59 61.72,5.59 J404.3
N$46
  Top 0.152: J403.3 64.77,4.37 58.62,10.52 45.94,10.52 U401.46
N$47
  Top 0.152: J404.2 66.04,3.86 59.08,10.82 46.34,10.82 U401.47
N$48
  Top 0.152: U401.48 46.75,11.12 59.44,11.12 65.53,5.03 66.75,5.03 67.31,4.47 J403.2
N$49
  Top 0.152: U401.49 47.15,11.43 59.74,11.43 65.84,5.33 67.06,5.33 J404.1
N$53
  Top 0.152: J405.12 67.31,26.06 60.6,19.36 46.75,19.36 U401.53
N$57
  Top 0.152: J405.10 62.23,26.01 56.79,20.57 45.31,20.57 44.58,19.84 44.4,19.84 U401.57
N$65
  Top 0.152: J405.6 52.07,26.06 49.02,23.01 41.92,23.01 U401.65
N$66
  Top 0.152: J406.5 50.8,26.62 47.5,23.32 41.52,23.32 U401.66
N$67
  Top 0.152: J405.5 49.53,26.11 47.04,23.62 41.11,23.62 U401.67
N$68
  Top 0.152: J406.4 45.52,23.93 40.71,23.93 U401.68
N$69
  Top 0.152: J405.4 46.99,26.01 45.21,24.23 40.31,24.23 U401.69
N$70
  Top 0.152: J406.3 45.72,26.57 43.69,24.54 39.91,24.54 U401.70
N$73
  Top 0.152: J405.2 41.91,26.11 41.25,25.45 38.7,25.45 U401.73
N$74
  Top 0.152: 40.48,26.67 J406.1 39.21,26.67 U401.74
N$75
  Top 0.152: J405.1 39.37,27.62 U401.75
N$76
  Top 0.152: U401.76 31.75,27.62 J407.13
N$77
  Top 0.152: 30.64,26.67 J408.12 31.91,26.67 U401.77
N$78
  Top 0.152: J407.12 29.21,26.11 29.87,25.45 32.42,25.45 U401.78
N$79
  Top 0.152: J408.11 27.94,26.62 29.41,25.15 32.02,25.15 U401.79
N$80
  Top 0.152: J407.11 26.67,26.06 27.89,24.84 31.62,24.84 U401.80
N$81
  Top 0.152: J408.10 25.4,26.57 27.43,24.54 31.21,24.54 U401.81
N$82
  Top 0.152: J407.10 24.13,26.01 25.91,24.23 30.81,24.23 U401.82
N$85
  Top 0.152: J408.8 20.32,26.62 23.62,23.32 29.6,23.32 U401.85
N$86
  Top 0.152: J407.8 19.05,26.06 22.1,23.01 29.2,23.01 U401.86
N$87
  Top 0.152: J408.7 17.78,26.57 21.64,22.71 28.8,22.71 U401.87
N$88
  Top 0.152: J407.7 16.51,26.01 20.12,22.4 28.4,22.4 U401.88
N$89
  Top 0.152: J408.6 19.81,22.1 28,22.1 U401.89
N$90
  Top 0.152: J407.6 13.97,26.11 18.29,21.79 27.59,21.79 U401.90
N$91
  Top 0.152: J408.5 12.7,26.62 17.83,21.49 27.19,21.49 U401.91
N$92
  Top 0.152: J407.5 11.43,26.06 16.31,21.18 26.79,21.18 U401.92
N$93
  Top 0.152: J408.4 10.16,26.57 15.85,20.88 26.39,20.88 U401.93
N$94
  Top 0.152: J407.4 8.89,26.01 14.33,20.57 25.98,20.57 U401.94
N$95
  Top 0.152: J408.3 14.02,20.27 25.58,20.27 U401.95
N$98
  Top 0.152: J407.2 3.81,26.06 10.52,19.36 24.37,19.36 U401.98
N$99
  Top 0.152: J408.1 2.54,26.57 10.06,19.05 23.97,19.05 U401.99
N$100
  Top 0.152: J407.1 1.27,26.01 8.53,18.75 23.48,18.75 U401.100
RESET  (via drill 0.33)
  Top 0.152: J401.9 21.59,4.37 24.08,6.86 30.01,6.86 U401.17 32.36,9.21 32.36,9.5 v33.02,10.16 | v35.33,12.01 34.95,12.39 34.95,23.6 35.43,24.08 35.43,24.56 34.9,25.09 34.9,27.05 33.86,27.05 S417.P$1 33.88,27.69
  Bottom 0.152: 33.53,10.67 | 33.53,10.67 R417.2 33.63,10.77 33.73,10.67 34.59,10.67 35.33,11.4 v35.33,12.01
  Bottom 0.686: v33.02,10.16 33.53,10.67
RTCX1  (via drill 0.33)
  Top 0.152: J402.8 20.32,3.86 23.62,7.16 29.6,7.16 U401.16 32,9.56 v32,10.16
  Bottom 0.152: S001.2 26.92,9.34 Y416.1 | v32,10.16 31.46,9.62 Y416.1 | Y416.1 27.32,9.62 C416.2
RTCX2  (via drill 0.33)
  Top 0.152: J402.9 25.6,6.55 30.41,6.55 U401.18 33,9.14 v33.02,9.14
  Bottom 0.152: v33.02,9.14 32.04,8.16 Y416.2 27.32,8.16 C418.2
SCK  (via drill 0.33)
  Top 0.152: J406.7 51.31,22.1 43.12,22.1 U401.62 41.45,20.42 39.95,18.92 v38.84,18.92
  Bottom 0.152: v38.84,18.92 SJ3.1
SD_CLK  (via drill 0.33)
  Top 0.152: J405.9 59.69,26.06 54.81,21.18 44.12,21.18 43.33,20.4 43.33,20.18 U401.59 42.52,19.36 42.04,18.87 v42.04,18.16
  Bottom 0.152: SJ3.3 37.39,17.2 41.07,17.2 v42.04,18.16
SD_CMD  (via drill 0.33)
  Top 0.152: J406.9 60.96,26.57 55.27,20.88 44.73,20.88 v44.4,20.55 U401.58
  Bottom 0.152: SJ4.3 39.09,20.19 39.45,20.55 v44.4,20.55
SD_DAT0  (via drill 0.33)
  Top 0.152: J406.10 57.1,20.27 45.54,20.27 U401.56 43.59,18.29 40.77,15.47 v40.77,14.17
  Bottom 0.152: SJ2.3 40.69,14.1 v40.77,14.17
SD_DAT1  (via drill 0.33)
  Top 0.152: J406.12 68.58,26.57 61.06,19.05 47.15,19.05 U401.52 45.01,16.87 41.68,13.54 39.57,13.54 37.47,15.65 37.47,16.56 37.62,16.71 v37.62,20.78
  Bottom 0.152: 7.06,7.09 J701.8 | J701.8 6.99,7.09 6.96,7.06 | 7.11,7.11 J701.8 | v37.62,20.78 37.11,20.78 34.11,23.77 13.61,23.77 4.78,14.94 4.78,8.13 5.82,7.08 J701.8
SD_DAT2  (via drill 0.33)
  Top 0.152: J405.13 69.85,26.01 62.59,18.75 47.63,18.75 47.38,18.49 | 47.38,18.49 46.74,17.85 | 46.74,17.85 U401.51 45.47,16.48 | 47.4,18.47 47.38,18.49 | v46.76,17.83 46.74,17.85
  Bottom 0.152: v46.76,17.83 44.64,19.95 40.27,19.95 40.13,20.09 39.45,20.09 39.24,19.89 36.58,19.89 36.27,19.58 30.96,19.58 30.48,20.07 16.71,20.07 11.43,14.78 J701.1
SD_DAT3  (via drill 0.33)
  Top 0.152: J403.1 69.85,4.47 69.29,5.03 67.82,5.03 67.21,5.64 65.99,5.64 59.89,11.73 47.63,11.73 U401.50 | 45.39,13.99 U401.50 | v43.26,13.54 44.45,14.73 44.7,14.73 45.47,13.97 U401.50
  Bottom 0.152: v43.26,13.54 38.02,13.54 34.42,17.14 SJ5.3
SD_PIN2
  Bottom 0.152: 7.49,13.69 J701.2 7.59,13.68 7.62,13.72 11.18,13.72 17.02,19.56 28.45,19.56 29.97,18.03 SJ5.2
SD_PIN3
  Bottom 0.152: J701.3 7.06,12.6 6.1,12.6 6.1,15.29 11.56,20.75 31.32,20.75 31.47,20.6 32.69,20.6 33.17,21.08 SJ4.2
SD_PIN5  (via drill 0.33)
  Top 0.152: v33.4,16.48 v33.4,18.03
  Bottom 0.152: v33.4,16.48 25.09,16.48 24.74,16.13 23.55,16.13 21.31,18.36 16.46,18.36 8.48,10.38 J701.5 | SJ3.2 v33.4,18.03
SD_PIN7  (via drill 0.33)
  Top 0.152: v36.22,16.15 35.53,16.84 v35.53,23.16
  Bottom 0.152: v36.22,16.15 37.39,14.99 SJ2.2 | v35.53,23.16 34.62,24.08 13.41,24.08 3.05,13.72 3.05,5.36 6.83,5.36 8.08,6.6 8.08,8.18 J701.7
USB_CONNECT  (via drill 0.33)
  Top 0.152: U401.64 42.32,22.71 49.48,22.71 53.34,26.57 J406.6 | v58.17,9.91 58.17,9.4 v59.94,7.62 | v53.34,18.03 53.34,12.7 v55.63,12.7
  Bottom 0.152: R051.2 63.09,6.37 Q050.1 61.21,6.37 61.21,6.6 60.71,7.11 60.45,7.11 v59.94,7.62 | v55.63,12.7 58.17,10.16 v58.17,9.91 | J406.6 v53.34,18.03
USB_D+
  Top 0.152: J404.11 43.18,3.86 41.71,5.33 39.1,5.33 U401.29
  Bottom 0.152: R030.1 C030.1 61.21,10.16 61.21,9.4 60.45,9.4 56.13,5.08 45.21,5.08 43.94,3.81 J404.11
USB_D-  (via drill 0.33)
  Top 0.152: J403.11 v44.45,5.33 44.15,5.64 39.5,5.64 U401.30
  Bottom 0.152: R020.1 63.5,11.43 63.25,11.68 C020.1 61.21,11.68 61.21,13.72 59.94,13.72 59.94,9.65 55.88,5.59 44.7,5.59 v44.45,5.33
USB_ON  (via drill 0.33)
  Top 0.152: J401.11 26.67,4.42 27.89,5.64 28.19,5.64 | 28.19,5.64 31.62,5.64 U401.21 | v62.23,12.7 62.99,11.94 69.01,11.94 S010.P$1 | v28.19,5.33 28.19,5.64
  Bottom 0.152: R010.1 v62.23,12.7 62.23,13.46 | 62.23,13.46 61.47,14.22 59.69,14.22 59.44,13.97 59.44,9.91 55.63,6.1 38.61,6.1 36.58,8.13 35.81,8.13 34.8,7.11 29.97,7.11 v28.19,5.33 | 62.23,13.46 62.85,13.46 R011.2
VBAT  (via drill 0.33)
  Top 0.152: J401.10 24.13,4.47 25.45,5.79 | 25.45,5.79 25.91,6.25 30.81,6.25 U401.19 32.95,8.38 v33.78,8.38 | S419.1 v21.08,17.78 | v25.91,5.33 25.45,5.79
  Bottom 0.152: C419.1 v33.78,8.38 | v33.78,8.38 | v21.08,17.78 20.47,17.17 20.47,12.09 18.54,10.16 18.54,7.37 20.57,5.33 v25.91,5.33
VBUS  (via drill 0.33)
  Top 0.152: C304.1 67.31,15.49 | C304.1 arc-90 67.2,15.49 66.26,15.49 U301.4 | D303.1 58.94,17.78 64.52,17.78 64.9,17.4 v64.9,15.24 66,15.24 U301.4 | C304.1 67.31,16.26 68.58,16.26 R304.2 | U301.4 66.04,15.34
  Bottom 0.152: v64.9,15.24 64.01,15.24 64.01,13.97 64.01,12.7 R010.2 65.28,12.7 65.79,12.19 65.79,11.68 66.04,11.43 66.8,11.43 66.83,11.46 J001.1
VCC(3V3)  (via drill 0.33)
  Top 0.152: C701.1 6.49,11.43 v5.44,11.43
  Bottom 0.152: v5.44,11.43 6.86,11.43 6.86,11.48 J701.4
VDD(3V3)  (via drill 0.33)
  Top 0.152: J403.12 41.91,4.37 41.25,5.03 38.66,5.03 37.61,6.08 U401.28 36.62,7.11 v36.58,7.11 36.65,7.16 37.03,7.54 37.03,22.3 v37.08,22.35 37.08,22.42 U401.71 39.5,24.84 43.23,24.84 44.45,26.06 J405.3 | J406.11 66.04,26.62 59.08,19.66 46.34,19.66 U401.54 43.45,16.76 v43.43,16.76 | J407.3 6.35,26.11 12.5,19.96 25.18,19.96 U401.96 28.07,17.07 v28.19,17.07 | v23.37,17.78 S428.2
  Bottom 0.152: J405.3 44.45,27.94 | 44.45,27.94 66.04,27.94 J406.11 | 44.45,27.94 30.48,27.94 30.43,27.99 7.57,27.99 J407.3 | C471.1 v37.08,22.35 | v37.08,22.35 | v28.19,17.07 27.54,17.73 C496.1 | v43.43,16.76 43.99,17.32 C454.1 | v36.58,7.11 C428.1 | 27.23,17.68 C496.1 | C496.1 27.23,17.68 24.69,17.68 24.59,17.78 v23.37,17.78
VDD(DCDC)  (via drill 0.33)
  Top 0.152: J401.7 16.51,4.47 20.12,8.08 28.4,8.08 U401.13 30.99,10.67 v30.99,11.18 30.94,11.23 30.94,14.86 23.42,14.86 S410.2 23.37,15.8 | J403.5 59.69,4.42 54.81,9.3 44.33,9.3 U401.42 41.4,12.23 v41.4,12.45 | S428.1 23.37,15.8 | S412.2 S419.2 S428.1 23.37,15.8 | J407.9 21.59,26.11 24.08,23.62 30.01,23.62 U401.84 32.45,21.18 v32.46,21.18 32.41,21.13 32.41,17.17 v31.14,15.9
  Bottom 0.152: 16.51,5.08 16.51,2.54 | 16.51,2.54 J401.7 | 16.51,2.54 59.69,2.54 J403.5 59.69,4.76 60.26,5.33 | C413.1 31.8,11.48 | v41.4,12.45 C442.1 49.22,18.14 49.23,18.14 49.63,18.54 52.32,18.54 52.58,18.29 52.58,17.78 53.09,17.27 53.59,17.27 54.1,17.78 54.1,20.57 57.4,20.57 | 32.51,12.19 30.48,14.22 30.48,15.24 v31.14,15.9 | 32.51,12.19 C413.1 | C413.1 | C413.1 32,11.68 | C205.1 59.69,24.13 59.69,21.62 | 59.69,21.62 U201.5 | R051.1 64.01,6.1 64.01,5.33 60.26,5.33 | 60.26,5.33 Q050.2 | 59.69,21.62 59.69,21.08 59.18,20.57 57.4,20.57 | 57.4,20.57 57.34,20.64 U101.3 57.34,22.81 C103.1 | 32.51,12.19 33.15,11.56 33.66,11.56 34.04,11.18 R417.1 | R417.1 | v30.99,11.18 31.5,11.18 C413.1 | v32.46,21.18 C484.1
VDDA  (via drill 0.33)
  Top 0.152: J402.5 12.7,3.86 17.83,8.99 27.19,8.99 U401.10 29.72,11.52 v29.72,12.45 | S410.1 v23.37,12.7 | U501.1 13.21,13.41 v13.21,12.45
  Bottom 0.152: C410.1 | C410.1 v29.72,12.45 29.46,12.7 v23.37,12.7 | v13.21,12.45 12.7,11.94 J402.5
VIN+  (via drill 0.33)
  Top 0.152: v55.88,15.75 56.13,16 58.17,16 58.42,16.26 D303.3
  Bottom 0.152: U101.5 56.39,17.92 | 56.39,17.92 R105.1 | 56.39,17.92 56.39,16.76 55.88,16.26 v55.88,15.75
VIN-  (via drill 0.33)
  Top 0.152: S201.3 56.26,13.66 v56.26,14.35
  Bottom 0.152: R105.2 57.34,17.99 U101.4 57.34,20.07 60.64,20.07 U201.1 60.64,18.08 C201.1 59.69,17.78 59.69,15.49 | R102.2 52.83,12.95 53.09,12.95 53.34,12.7 54.61,12.7 v56.26,14.35 56.64,14.73 56.64,16.26 57.1,16.71 57.15,16.71 57.4,16.97 57.4,17.78 R105.2 | 57.66,17.89 R105.2
VLIPO  (via drill 0.33)
  Top 0.152: U301.3 63.28,15.49 61.98,15.49 C303.1 | D303.2 arc-90 58.88,15.49 61.86,15.49 arc90 C303.1 | v62.23,14.48 C303.1
  Bottom 0.152: J301.2 62.21,20.56 61.47,19.81 61.47,18.03 62.23,17.27 v62.23,14.48
VREF  (via drill 0.33)
  Top 0.152: J402.6 19.81,8.38 28,8.38 U401.12 30.35,10.74 v30.35,11.81 | S412.1 v21.08,12.7
  Bottom 0.152: C412.1 31.04,12.24 30.61,11.81 v30.35,11.81 29.34,11.81 28.96,12.19 23.88,12.19 23.62,11.94 21.84,11.94 v21.08,12.7
XTAL1  (via drill 0.33)
  Top 0.152: J402.11 27.94,3.86 29.41,5.33 32.02,5.33 U401.22 34.05,7.37 34.54,7.37 35.56,6.35 35.56,2.36 36.21,1.71 C422.2 36.27,1.52 | v37.59,1.52 36.27,1.52 | 36.27,1.52 Y422.1
  Bottom 0.152: 36.2,1.5 C422.2 v37.59,1.52
XTAL2  (via drill 0.33)
  Top 0.152: J401.12 29.21,4.37 29.87,5.03 32.42,5.03 U401.23 34.25,6.86 34.44,6.86 35.2,6.1 35.2,4.08 Y422.3 34.68,3.56 v33.53,3.56
  Bottom 0.152: C423.2 v33.53,3.56

### Text on the board
tPlace: Reset | 95 | 90 | 85 | 80 | 70 | 65 | 60 | 55 | St Kwan's Home for | the Terminally ADD | LPC2368 Breakout v2 | a division of Kwan Systems | 12 Jul 2014 | BAT | 3V3 | stkwans.blogspot.com | AGND | CURRENT | Charge | 2V5 | VREF | VDDA | BATLVL | ON | Boot | 5 | 10 | 15 | 20 | 30 | 35 | 40 | 45 | USB
bPlace: SPI | SD